# EAGLE design db9 (EAGLE 9.6.2)
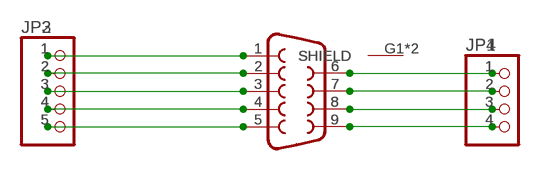
[diagram p0: schematic, sheet 1]

## Parts
J1  DB9MALE  [DB9_MALE]
J2  DB9MALE  [DB9_MALE]
JP1  PINHD-1X4  [1X04]
JP2  PINHD-1X5  [1X05]
JP3  PINHD-1X5  [1X05]
JP4  PINHD-1X4  [1X04]

## Nets
N$1: J1.1 J2.1 JP2.1 JP3.1
N$2: J1.6 J2.6 JP1.1 JP4.1
N$3: J1.2 J2.2 JP2.2 JP3.2
N$4: J1.7 J2.7 JP1.2 JP4.2
N$5: J1.3 J2.3 JP2.3 JP3.3
N$6: J1.8 J2.8 JP1.3 JP4.3
N$7: J1.4 J2.4 JP2.4 JP3.4
N$8: J1.9 J2.9 JP1.4 JP4.4
N$9: J1.5 J2.5 JP2.5 JP3.5
N$10: J1.G1(SHIELD) J1.G2(SHIELD) J2.G1(SHIELD) J2.G2(SHIELD)

## Library data of the parts
J1 J2 = SparkFun-Connectors:DB9: DB9 Connector Standard DB9 (D-Sub 9) serial connector. Can be used for CAN bus as well as RS485 and RS232. Footprint production proven. Here is the female version connector we sell at SparkFun: 9 Pin Female Serial Connector - PCB Mount <https://www.sparkfun.com/products/429> (PRT-00429) This connector has been used on the following SparkFun products: SparkFun RS232 Shifter - SMD <https://www.sparkfun.com/products/449> (PRT-00449) SparkFun RS232 Shifter SMD (No DB9) <https://www.sparkfun.com/products/8780> (PRT-08780); PROD_ID: CONN-09904
JP1 JP4 = pinhead:PINHD-1X4: PIN HEADER
JP2 JP3 = pinhead:PINHD-1X5: PIN HEADER

## Net classes
1 power: width 0.178 mm

## Board
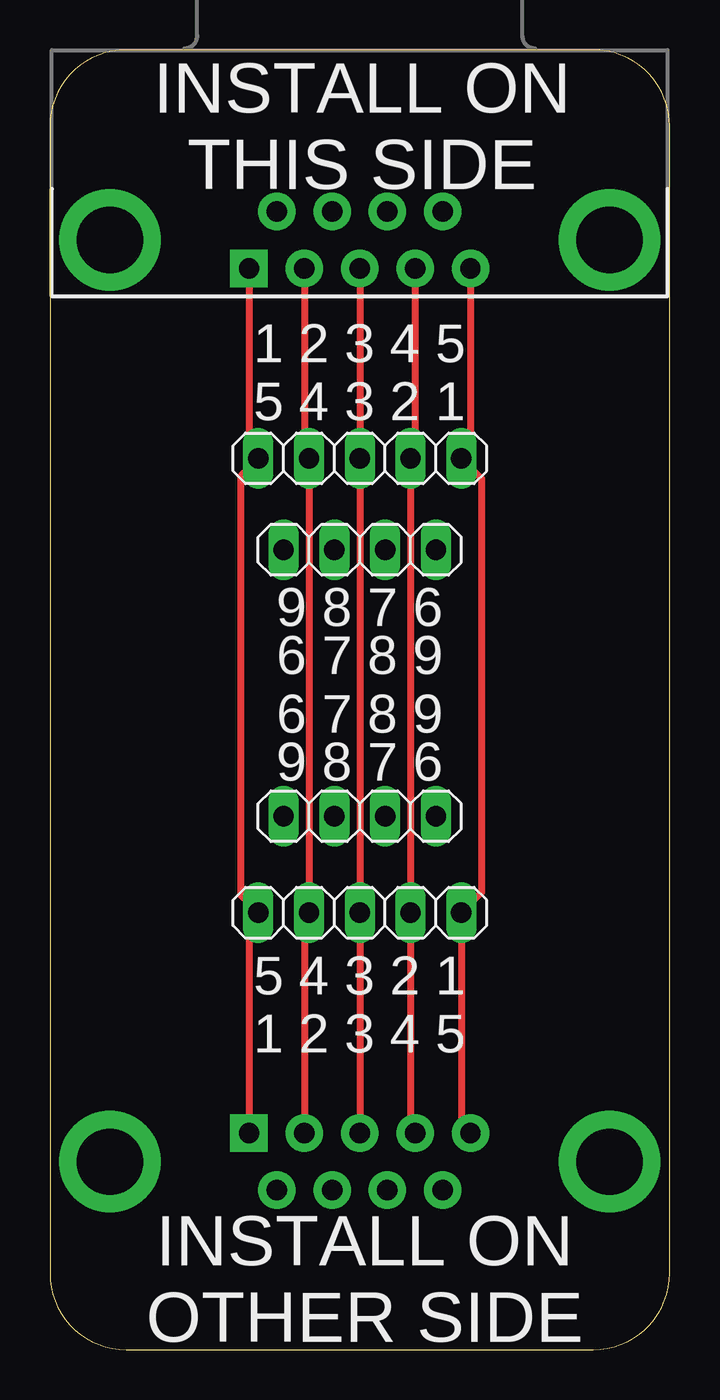
[diagram p1: board, top side]
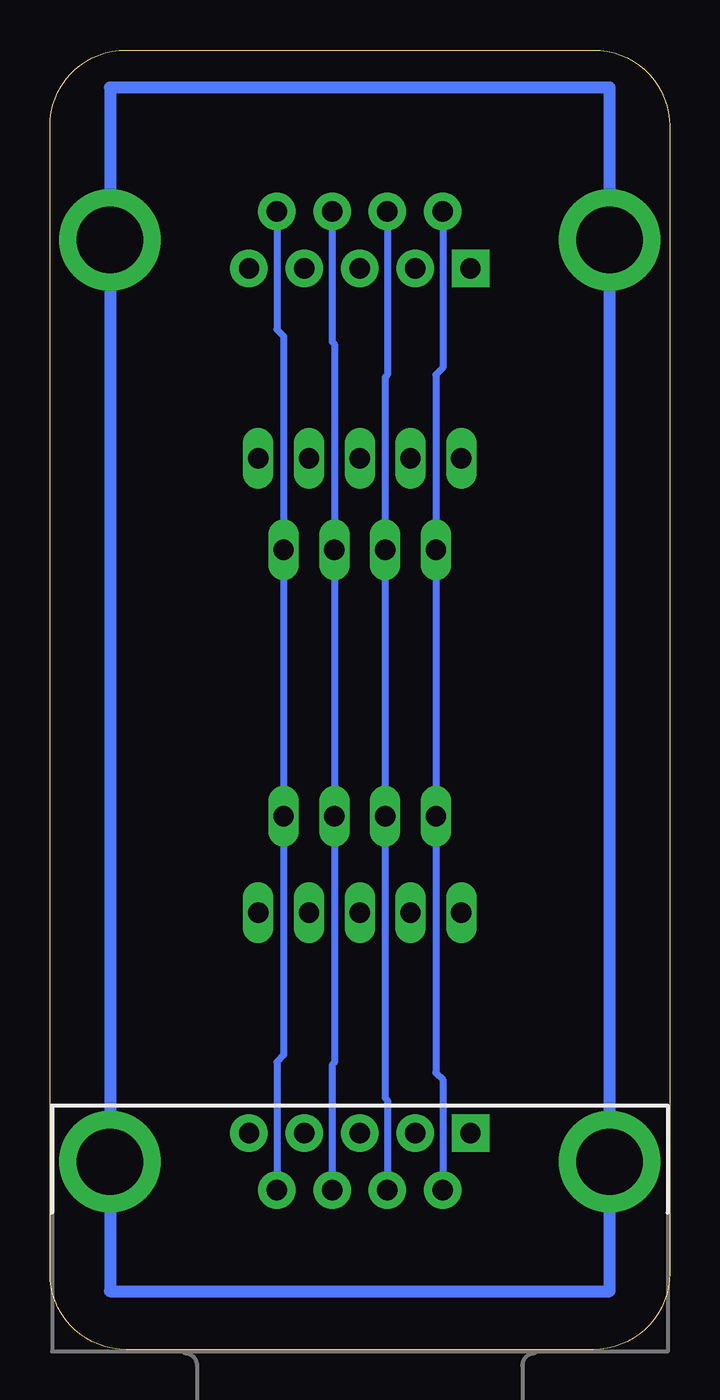
[diagram p2: board, bottom side, seen from below]

Size 31 x 65 mm. Coordinates in mm from the lower left corner, seen from the top.
Outline: 0,61.19 0,3.81 arc90 3.81,0 27.19,0 arc90 31,3.81 31,61.19 arc90 27.19,65 3.81,65 arc90 0,61.19
Copper layers (1*16): Top 0.035mm / dielectric 1.5mm / Bottom 0.035mm
Design rules "deku_2layer_6mil": minimum track width 6mil, minimum drill 15mil, track to track 6mil, track to pad 6mil, pad to pad 6mil, via to via 6mil, smd to smd 6mil, copper to edge 10mil, drill to drill 6mil, minimum pad ring 7mil, minimum via ring 7mil, stop-mask expansion 4mil, vias tented up to drill 25mil, thermal gap 10mil

### Footprints (pad centres in the part's own frame; a part is rotated, then mirrored left to right if it is on the bottom)
DB9_MALE = drill 1.016 pad 1.88: 1 5.54,-1.42; 2 2.77,-1.42; 3 0,-1.42; 4 -2.77,-1.42; 6 4.15,1.42; 7 1.38,1.42; 8 -1.38,1.42; 9 -4.15,1.42 | drill 1.016 pad 1.88 square: 5 -5.54,-1.42 | drill 3.302 pad 5.08: G1 -12.5,0; G2 12.5,0
1X04 = drill 1.016 long: 1 -3.81,0; 2 -1.27,0; 3 1.27,0; 4 3.81,0
1X05 = drill 1.016 long: 1 -5.08,0; 2 -2.54,0; 3 0,0; 4 2.54,0; 5 5.08,0

### Placement (x,y rotation side)
J1  15.5,55.5 0 top
J2  15.5,9.4 180 bottom
JP1  15.5,40.01 180 top
JP2  15.5,44.58 180 top
JP3  15.5,21.84 180 top
JP4  15.5,26.67 180 top

### Tracks (layer width: path | path; a pad name or v marks a point on that pad's centre or on a via)
N$1
  Top 0.356: J1.1 21.04,45.04 JP2.1 21.59,43.57 21.59,22.85 JP3.1 20.58,11.28 J2.1
N$2
  Bottom 0.356: J1.6 19.65,51.02 19.31,50.68 JP1.1 JP4.1 19.31,14.73 19.65,14.39 J2.6
N$3
  Top 0.356: J1.2 18.27,44.81 JP2.2 JP3.2 18.04,11.05 J2.2
N$4
  Bottom 0.356: J1.7 16.88,50.41 16.76,50.29 JP1.2 JP4.2 16.77,14.36 16.76,14.35 16.88,14.23 J2.7
N$5
  Top 0.356: J1.3 JP2.3 JP3.3 J2.3
N$6
  Bottom 0.356: J1.8 14.12,48.74 14.23,48.63 JP1.3 JP4.3 14.23,12.58 14.12,12.47 J2.8
N$7
  Top 0.356: J1.4 12.73,44.81 JP2.4 JP3.4 12.73,21.61 J2.4
N$8
  Bottom 0.356: J1.9 11.35,49.1 11.69,48.76 JP1.4 JP4.4 11.69,13.85 11.35,13.51 J2.9
N$9
  Top 0.356: J1.5 9.96,45.04 JP2.5 9.53,43.68 9.53,22.74 JP3.5 9.96,21.38 J2.5
N$10
  Bottom 0.61: J1.G1 3,63.12 28,63.12 J1.G2 J2.G2 28,2.92 3,2.92 J2.G1 J1.G1

### Text on the board
tPlace: INSTALL ON / THIS SIDE | 1 2 3 4 5 / 5 4 3 2 1 | 9 8 7 6 / 6 7 8 9 | 6 7 8 9 / 9 8 7 6 | 5 4 3 2 1 / 1 2 3 4 5 | INSTALL ON / OTHER SIDE